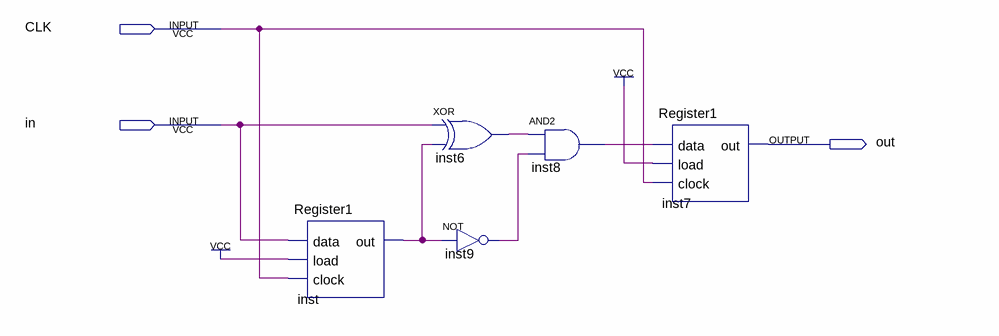
[diagram p0: schematic sheet]
// Quartus schematic BT-input.bdf as structural Verilog: 5 symbols, 3 pins
module \BT-input  (
  input  CLK,
  input  in,
  output out
);

  wire inst6_out, inst8_out, inst9_out, inst_out;

  Register1 inst (.data(in), .load(1'b1), .clock(CLK), .out(inst_out));
  xor inst6 (inst6_out, in, inst_out);
  not inst9 (inst9_out, inst_out);
  and inst8 (inst8_out, inst6_out, inst9_out);
  Register1 inst7 (.data(inst8_out), .load(1'b1), .clock(CLK), .out(out));
endmodule
